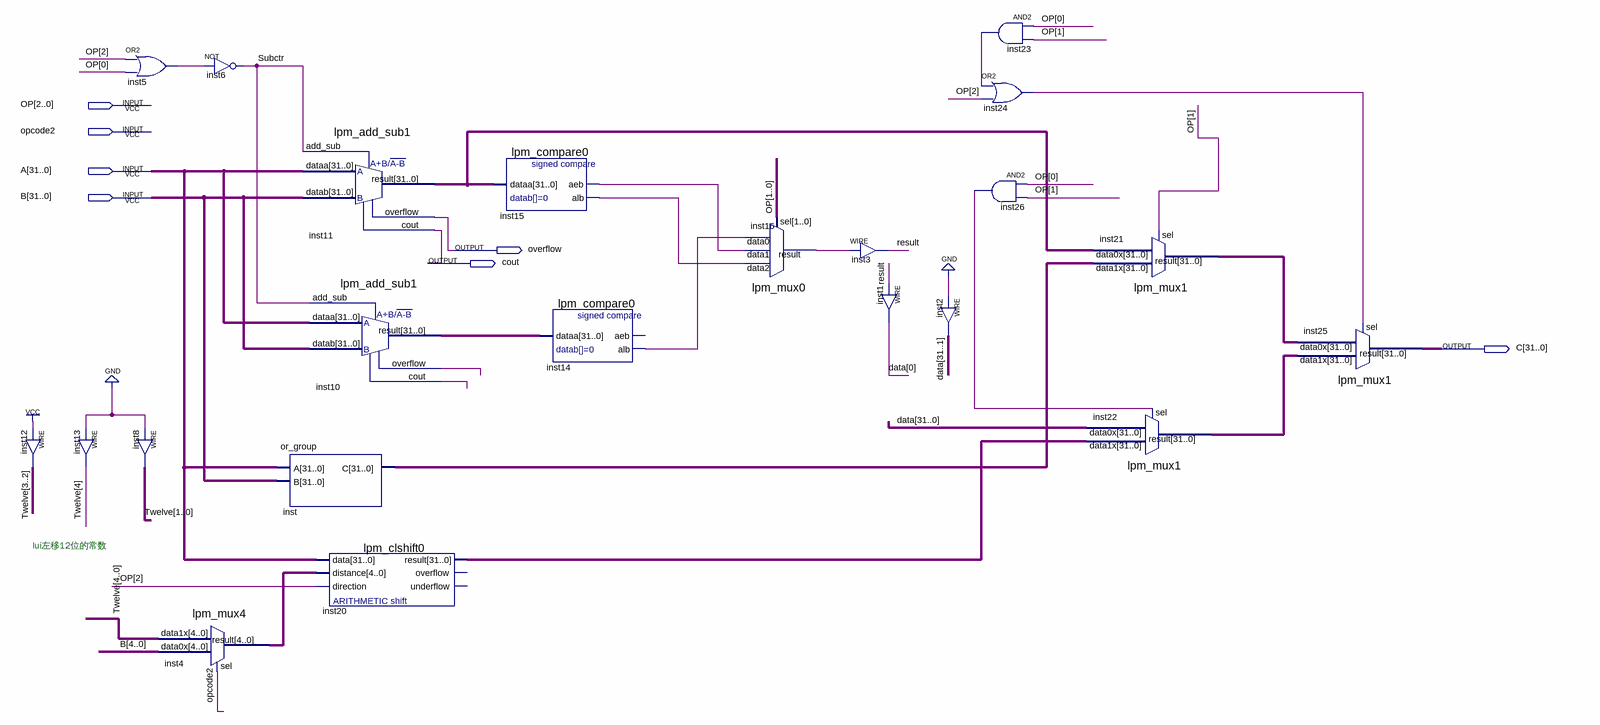
[diagram p0: schematic sheet]
// Quartus schematic ALU_try.bdf as structural Verilog: 22 symbols, 7 pins
module ALU_try (
  input  [2:0] OP,
  input  opcode2,
  input  [31:0] A,
  input  [31:0] B,
  output overflow,
  output cout,
  output [31:0] C
);

  wire inst5_out, inst10_cout, inst10_overflow, inst14_alb, inst15_aeb, inst15_alb, inst16_result,
       inst23_out, inst24_out, inst26_out, result, Subctr;
  wire [4:0] inst4_result, Twelve;
  wire [31:0] data, inst10_result, inst11_result, inst20_result, inst21_result, inst22_result, inst_c;

  assign Twelve[3:2] = 2'b11;  // WIRE inst12
  assign Twelve[4] = 1'b0;  // WIRE inst13
  or inst5 (inst5_out, OP[2], OP[0]);
  assign Twelve[1:0] = 2'b00;  // WIRE inst8
  lpm_mux4 inst4 (.data1x(Twelve), .data0x(B[4:0]), .sel(opcode2), .result(inst4_result));
  not inst6 (Subctr, inst5_out);
  or_group inst (.A(A), .B(B), .C(inst_c));
  lpm_add_sub1 inst11 (
    .dataa(A), .datab(B), .add_sub(Subctr), .result(inst11_result), .overflow(overflow), .cout(cout));
  lpm_add_sub1 inst10 (
    .dataa(A), .datab(B), .add_sub(Subctr), .result(inst10_result), .overflow(inst10_overflow),
    .cout(inst10_cout));
  lpm_clshift0 inst20 (
    .data(A), .distance(inst4_result), .direction(OP[2]), .result(inst20_result));  // open: overflow, underflow
  lpm_compare0 inst15 (.dataa(inst11_result), .aeb(inst15_aeb), .alb(inst15_alb));
  lpm_compare0 inst14 (.dataa(inst10_result), .alb(inst14_alb));  // open: aeb
  lpm_mux0 inst16 (.data2(inst15_alb), .data1(inst15_aeb), .data0(inst14_alb), .sel(OP[1:0]), .result(inst16_result));
  assign result = inst16_result;  // WIRE inst3
  assign data[0] = result;  // WIRE inst1
  and inst23 (inst23_out, OP[0], OP[1]);
  or inst24 (inst24_out, inst23_out, OP[2]);
  and inst26 (inst26_out, OP[0], OP[1]);
  assign data[31:1] = {31{1'b0}};  // WIRE inst2
  lpm_mux1 inst22 (.data1x(inst20_result), .data0x(data), .sel(inst26_out), .result(inst22_result));
  lpm_mux1 inst21 (.data1x(inst_c), .data0x(inst11_result), .sel(OP[1]), .result(inst21_result));
  lpm_mux1 inst25 (.data1x(inst22_result), .data0x(inst21_result), .sel(inst24_out), .result(C));

  // Notes on the sheet:
  //   lui左移12位的常数
endmodule
